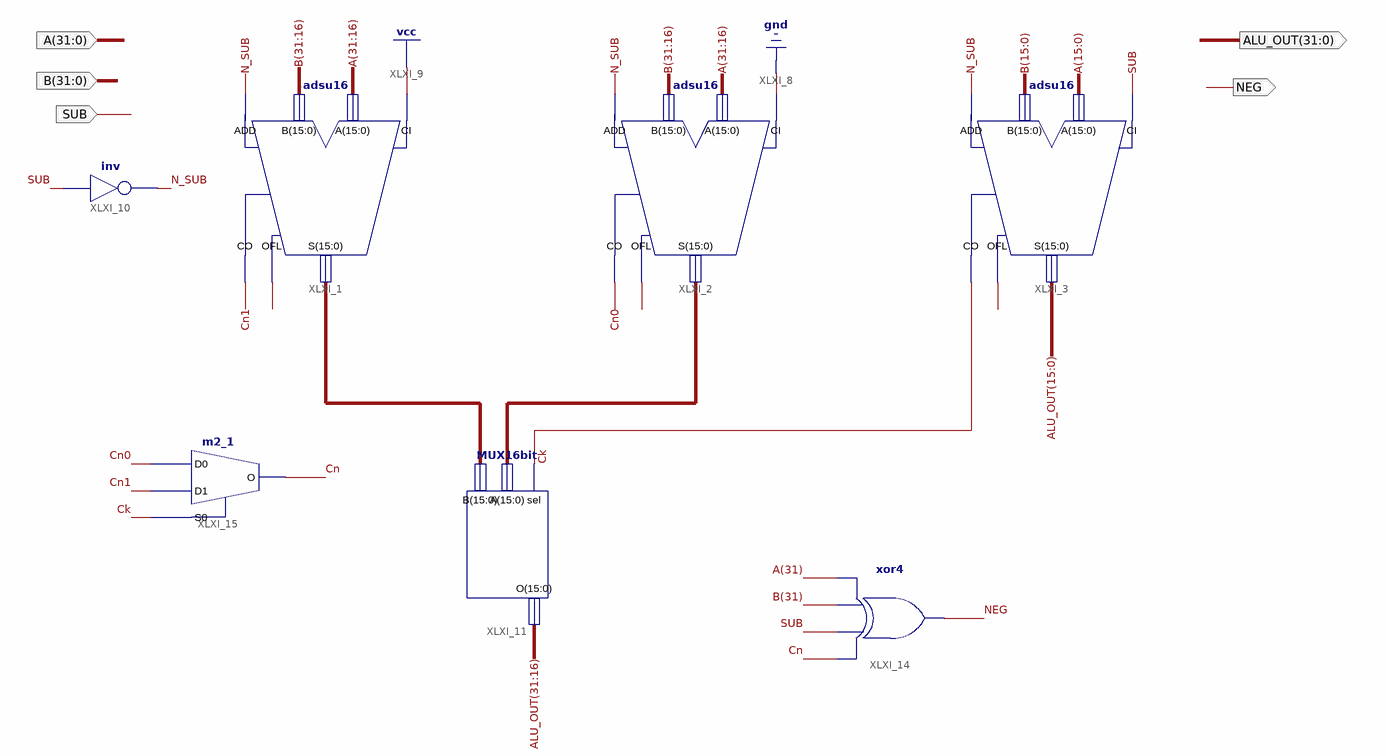
[diagram p0: schematic sheet 1]
// Xilinx ISE schematic CSA32.sch (spartan6) as structural Verilog: 7 symbols, 5 ports
module CSA32 (
  input  [31:0] A,
  input  SUB,
  input  [31:0] B,
  output [31:0] ALU_OUT,
  output NEG
);

  wire Ck, Cn, Cn0, Cn1, N_SUB, XLXN_23, XLXN_26, XLXN_29;
  wire [15:0] XLXN_24, XLXN_54;

  adsu16 XLXI_1 (.A(A[31:16]), .ADD(N_SUB), .B(B[31:16]), .CI(1'b1), .CO(Cn1), .OFL(XLXN_23), .S(XLXN_24));
  adsu16 XLXI_2 (.A(A[31:16]), .ADD(N_SUB), .B(B[31:16]), .CI(1'b0), .CO(Cn0), .OFL(XLXN_26), .S(XLXN_54));
  adsu16 XLXI_3 (.A(A[15:0]), .ADD(N_SUB), .B(B[15:0]), .CI(SUB), .CO(Ck), .OFL(XLXN_29), .S(ALU_OUT[15:0]));
  not XLXI_10 (N_SUB, SUB);
  MUX16bit XLXI_11 (.sel(Ck), .A(XLXN_54), .B(XLXN_24), .O(ALU_OUT[31:16]));
  xor XLXI_14 (NEG, Cn, SUB, B[31], A[31]);
  m2_1 XLXI_15 (.D0(Cn0), .D1(Cn1), .S0(Ck), .O(Cn));
endmodule
